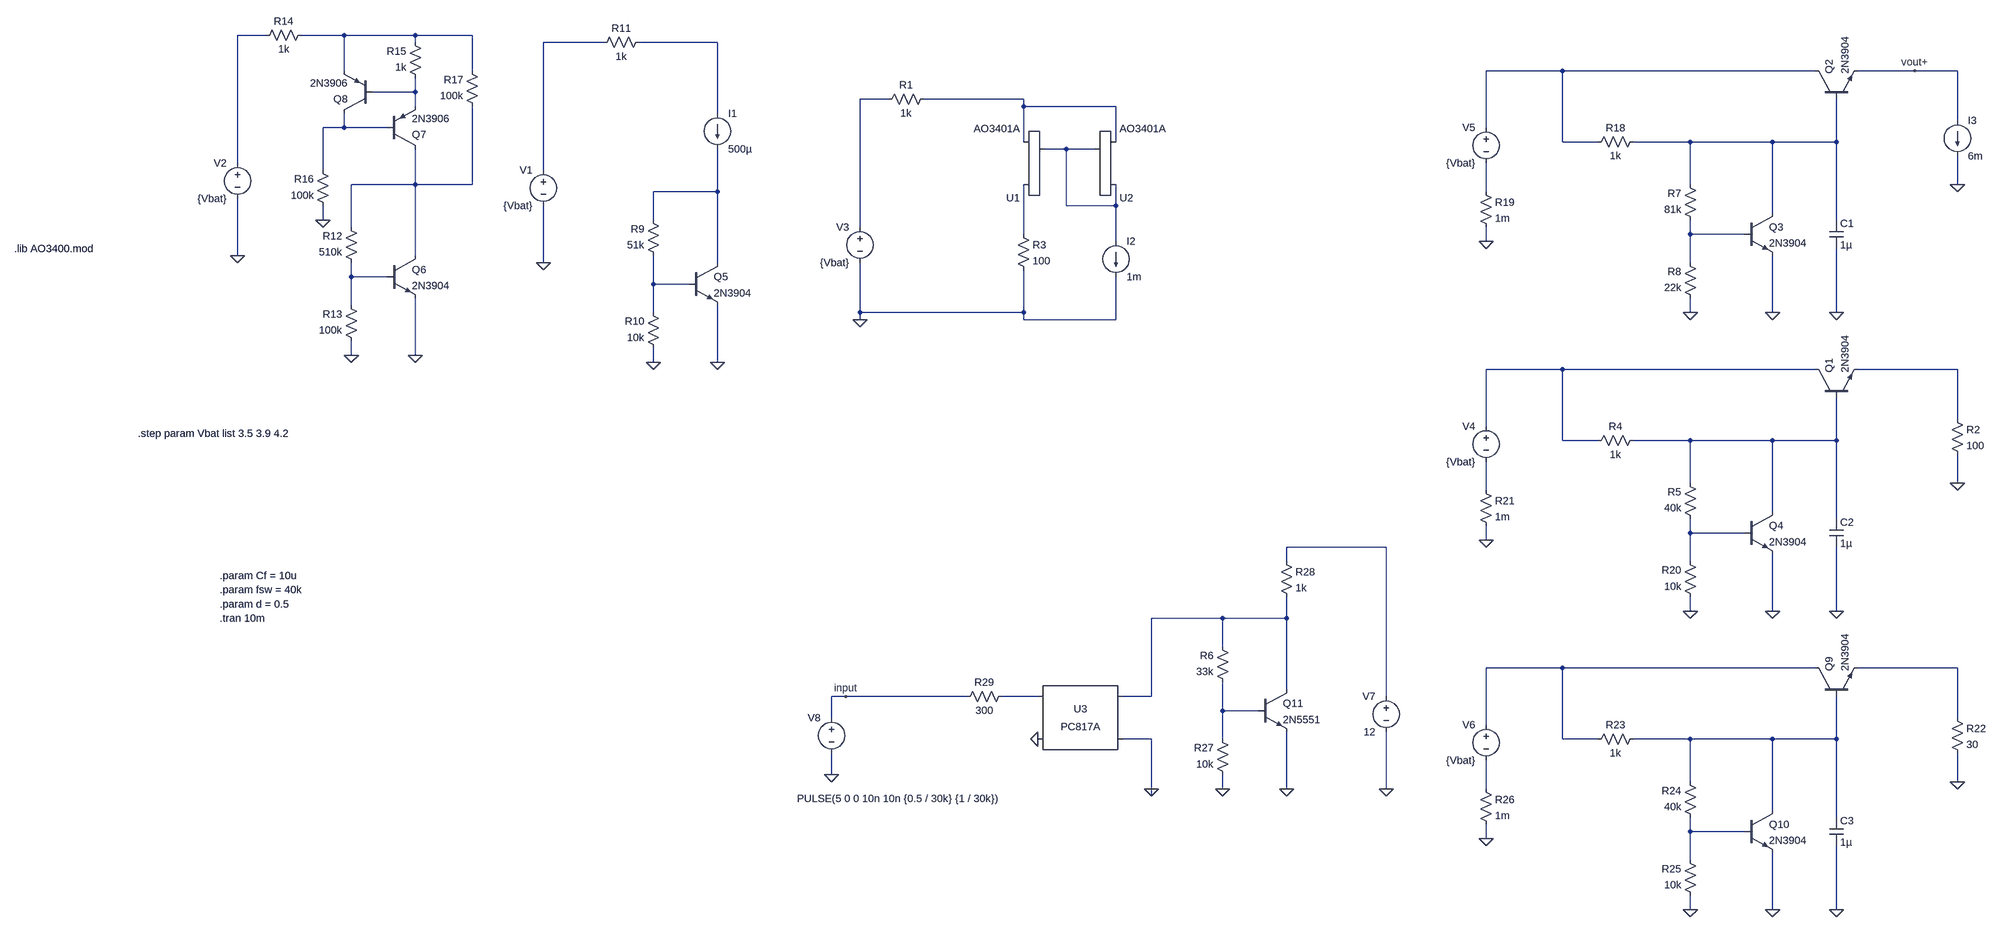
[diagram p0: schematic vbe_multiplier.asc]
vbe_multiplier.asc, the LTspice schematic file:
Version 4
SHEET 1 11460 3748
WIRE -896 -368 -960 -368
WIRE -720 -368 -816 -368
WIRE -560 -368 -720 -368
WIRE -432 -368 -560 -368
WIRE -560 -352 -560 -368
WIRE -128 -352 -272 -352
WIRE 128 -352 -48 -352
WIRE -720 -288 -720 -368
WIRE -432 -288 -432 -368
WIRE 3568 -288 3328 -288
WIRE 4272 -288 3568 -288
WIRE 4496 -288 4368 -288
WIRE 4592 -288 4496 -288
WIRE -560 -240 -560 -272
WIRE -560 -240 -656 -240
WIRE 848 -224 784 -224
WIRE 1152 -224 928 -224
WIRE -560 -208 -560 -240
WIRE 1152 -208 1152 -224
WIRE 1360 -208 1152 -208
WIRE 128 -192 128 -352
WIRE 4592 -176 4592 -288
WIRE -720 -160 -720 -192
WIRE -720 -160 -768 -160
WIRE -624 -160 -720 -160
WIRE 3328 -160 3328 -288
WIRE 1152 -128 1152 -208
WIRE 1360 -128 1360 -208
WIRE 3568 -128 3568 -288
WIRE 3648 -128 3568 -128
WIRE 3856 -128 3728 -128
WIRE 4176 -128 3856 -128
WIRE 4320 -128 4320 -224
WIRE 4320 -128 4176 -128
WIRE 1248 -112 1200 -112
WIRE 1312 -112 1248 -112
WIRE -960 -80 -960 -368
WIRE -768 -64 -768 -160
WIRE -272 -64 -272 -352
WIRE -560 -32 -560 -112
WIRE -560 -32 -704 -32
WIRE -432 -32 -432 -208
WIRE -432 -32 -560 -32
WIRE 3856 -32 3856 -128
WIRE 4592 -32 4592 -96
WIRE 128 -16 128 -112
WIRE 128 -16 -16 -16
WIRE 3328 -16 3328 -80
WIRE 1248 16 1248 -112
WIRE 1360 16 1360 -32
WIRE 1360 16 1248 16
WIRE 4176 32 4176 -128
WIRE -768 48 -768 16
WIRE -16 48 -16 -16
WIRE 4320 48 4320 -128
WIRE -704 64 -704 -32
WIRE 784 64 784 -224
WIRE 1152 80 1152 -32
WIRE 3856 80 3856 48
WIRE 4112 80 3856 80
WIRE 1360 96 1360 16
WIRE 3328 96 3328 64
WIRE -960 128 -960 0
WIRE -560 128 -560 -32
WIRE -272 144 -272 16
WIRE 128 144 128 -16
WIRE 3856 144 3856 80
WIRE -704 176 -704 144
WIRE -624 176 -704 176
WIRE -16 192 -16 128
WIRE 64 192 -16 192
WIRE -704 240 -704 176
WIRE -16 256 -16 192
WIRE 784 256 784 144
WIRE 1152 256 1152 160
WIRE 1152 256 784 256
WIRE 3856 256 3856 224
WIRE 4176 256 4176 128
WIRE 4320 256 4320 112
WIRE 784 272 784 256
WIRE 1152 272 1152 256
WIRE 1360 272 1360 176
WIRE 1360 272 1152 272
WIRE -704 352 -704 320
WIRE -560 352 -560 224
WIRE -16 368 -16 336
WIRE 128 368 128 240
WIRE 3568 384 3328 384
WIRE 4272 384 3568 384
WIRE 4592 384 4368 384
WIRE 4592 496 4592 384
WIRE 3328 512 3328 384
WIRE 3568 544 3568 384
WIRE 3648 544 3568 544
WIRE 3856 544 3728 544
WIRE 4176 544 3856 544
WIRE 4320 544 4320 448
WIRE 4320 544 4176 544
WIRE 3856 640 3856 544
WIRE 4592 640 4592 576
WIRE 3328 656 3328 592
WIRE 4176 704 4176 544
WIRE 4320 720 4320 544
WIRE 3856 752 3856 720
WIRE 4112 752 3856 752
WIRE 3328 768 3328 736
WIRE 1968 784 1744 784
WIRE 1744 816 1744 784
WIRE 3856 816 3856 752
WIRE 3856 928 3856 896
WIRE 4176 928 4176 800
WIRE 4320 928 4320 784
WIRE 1600 944 1440 944
WIRE 1744 944 1744 896
WIRE 1744 944 1600 944
WIRE 1600 1008 1600 944
WIRE 3568 1056 3328 1056
WIRE 4272 1056 3568 1056
WIRE 4592 1056 4368 1056
WIRE 1744 1104 1744 944
WIRE 752 1120 720 1120
WIRE 1024 1120 752 1120
WIRE 1184 1120 1104 1120
WIRE 1440 1120 1440 944
WIRE 1440 1120 1376 1120
WIRE 1968 1120 1968 784
WIRE 1600 1152 1600 1088
WIRE 1680 1152 1600 1152
WIRE 720 1168 720 1120
WIRE 4592 1168 4592 1056
WIRE 3328 1184 3328 1056
WIRE 1440 1216 1376 1216
WIRE 1600 1216 1600 1152
WIRE 3568 1216 3568 1056
WIRE 3648 1216 3568 1216
WIRE 3856 1216 3728 1216
WIRE 4176 1216 3856 1216
WIRE 4320 1216 4320 1120
WIRE 4320 1216 4176 1216
WIRE 720 1296 720 1248
WIRE 3856 1312 3856 1216
WIRE 4592 1312 4592 1248
WIRE 1440 1328 1440 1216
WIRE 1600 1328 1600 1296
WIRE 1744 1328 1744 1200
WIRE 1968 1328 1968 1200
WIRE 3328 1328 3328 1264
WIRE 1440 1344 1440 1328
WIRE 4176 1376 4176 1216
WIRE 4320 1392 4320 1216
WIRE 3856 1424 3856 1392
WIRE 4112 1424 3856 1424
WIRE 3328 1440 3328 1408
WIRE 3856 1488 3856 1424
WIRE 3856 1600 3856 1568
WIRE 4176 1600 4176 1472
WIRE 4320 1600 4320 1456
FLAG 128 368 0
FLAG -16 368 0
FLAG -272 144 0
FLAG -560 352 0
FLAG -704 352 0
FLAG -960 128 0
FLAG -768 48 0
FLAG 784 272 0
FLAG 4320 256 0
FLAG 4592 -32 0
FLAG 4496 -288 vout+
FLAG 3328 96 0
FLAG 4176 256 0
FLAG 3856 256 0
FLAG 4320 928 0
FLAG 4592 640 0
FLAG 3328 768 0
FLAG 4176 928 0
FLAG 3856 928 0
FLAG 4320 1600 0
FLAG 4592 1312 0
FLAG 3328 1440 0
FLAG 4176 1600 0
FLAG 3856 1600 0
FLAG 1744 1328 0
FLAG 1600 1328 0
FLAG 1968 1328 0
FLAG 720 1296 0
FLAG 752 1120 input
FLAG 1184 1216 0
FLAG 1440 1328 0
SYMBOL npn 64 144 R0
SYMATTR InstName Q5
SYMATTR Value 2N3904
SYMBOL res 0 144 R180
WINDOW 0 36 76 Left 2
WINDOW 3 36 40 Left 2
SYMATTR InstName R9
SYMATTR Value 51k
SYMBOL res 0 352 R180
WINDOW 0 36 76 Left 2
WINDOW 3 36 40 Left 2
SYMATTR InstName R10
SYMATTR Value 10k
SYMBOL voltage -272 -80 M0
WINDOW 123 0 0 Left 0
WINDOW 39 0 0 Left 0
SYMATTR InstName V1
SYMATTR Value {Vbat}
SYMBOL res -32 -368 R90
WINDOW 0 0 56 VBottom 2
WINDOW 3 32 56 VTop 2
SYMATTR InstName R11
SYMATTR Value 1k
SYMBOL current 128 -192 R0
WINDOW 123 0 0 Left 0
WINDOW 39 0 0 Left 0
SYMATTR InstName I1
SYMATTR Value 500µ
SYMBOL npn -624 128 R0
SYMATTR InstName Q6
SYMATTR Value 2N3904
SYMBOL res -688 160 R180
WINDOW 0 36 76 Left 2
WINDOW 3 36 40 Left 2
SYMATTR InstName R12
SYMATTR Value 510k
SYMBOL res -688 336 R180
WINDOW 0 36 76 Left 2
WINDOW 3 36 40 Left 2
SYMATTR InstName R13
SYMATTR Value 100k
SYMBOL voltage -960 -96 M0
WINDOW 123 0 0 Left 0
WINDOW 39 0 0 Left 0
SYMATTR InstName V2
SYMATTR Value {Vbat}
SYMBOL res -800 -384 R90
WINDOW 0 0 56 VBottom 2
WINDOW 3 32 56 VTop 2
SYMATTR InstName R14
SYMATTR Value 1k
SYMBOL pnp -624 -112 M180
SYMATTR InstName Q7
SYMATTR Value 2N3906
SYMBOL pnp -656 -192 R180
SYMATTR InstName Q8
SYMATTR Value 2N3906
SYMBOL res -544 -256 R180
WINDOW 0 36 76 Left 2
WINDOW 3 36 40 Left 2
SYMATTR InstName R15
SYMATTR Value 1k
SYMBOL res -752 32 R180
WINDOW 0 36 76 Left 2
WINDOW 3 36 40 Left 2
SYMATTR InstName R16
SYMATTR Value 100k
SYMBOL res -416 -192 R180
WINDOW 0 36 76 Left 2
WINDOW 3 36 40 Left 2
SYMATTR InstName R17
SYMATTR Value 100k
SYMBOL voltage 784 48 M0
WINDOW 123 0 0 Left 0
WINDOW 39 0 0 Left 0
SYMATTR InstName V3
SYMATTR Value {Vbat}
SYMBOL res 944 -240 R90
WINDOW 0 0 56 VBottom 2
WINDOW 3 32 56 VTop 2
SYMATTR InstName R1
SYMATTR Value 1k
SYMBOL AO3401A 1120 -64 R180
SYMATTR InstName U1
SYMBOL AO3401A 1392 -64 M180
SYMATTR InstName U2
SYMBOL res 1136 64 R0
SYMATTR InstName R3
SYMATTR Value 100
SYMBOL current 1360 96 R0
WINDOW 123 0 0 Left 0
WINDOW 39 0 0 Left 0
SYMATTR InstName I2
SYMATTR Value 1m
SYMBOL npn 4272 -224 R270
SYMATTR InstName Q2
SYMATTR Value 2N3904
SYMBOL cap 4304 48 R0
SYMATTR InstName C1
SYMATTR Value 1µ
SYMBOL res 3632 -112 R270
WINDOW 0 32 56 VTop 2
WINDOW 3 0 56 VBottom 2
SYMATTR InstName R18
SYMATTR Value 1k
SYMBOL voltage 3328 -176 M0
WINDOW 123 0 0 Left 0
WINDOW 39 0 0 Left 0
SYMATTR InstName V5
SYMATTR Value {Vbat}
SYMBOL npn 4112 32 R0
SYMATTR InstName Q3
SYMATTR Value 2N3904
SYMBOL res 3872 64 R180
WINDOW 0 36 76 Left 2
WINDOW 3 36 40 Left 2
SYMATTR InstName R7
SYMATTR Value 81k
SYMBOL res 3872 240 R180
WINDOW 0 36 76 Left 2
WINDOW 3 36 40 Left 2
SYMATTR InstName R8
SYMATTR Value 22k
SYMBOL res 3312 -32 R0
SYMATTR InstName R19
SYMATTR Value 1m
SYMBOL npn 4272 448 R270
SYMATTR InstName Q1
SYMATTR Value 2N3904
SYMBOL res 4576 480 R0
SYMATTR InstName R2
SYMATTR Value 100
SYMBOL cap 4304 720 R0
SYMATTR InstName C2
SYMATTR Value 1µ
SYMBOL res 3632 560 R270
WINDOW 0 32 56 VTop 2
WINDOW 3 0 56 VBottom 2
SYMATTR InstName R4
SYMATTR Value 1k
SYMBOL voltage 3328 496 M0
WINDOW 123 0 0 Left 0
WINDOW 39 0 0 Left 0
SYMATTR InstName V4
SYMATTR Value {Vbat}
SYMBOL npn 4112 704 R0
SYMATTR InstName Q4
SYMATTR Value 2N3904
SYMBOL res 3872 736 R180
WINDOW 0 36 76 Left 2
WINDOW 3 36 40 Left 2
SYMATTR InstName R5
SYMATTR Value 40k
SYMBOL res 3872 912 R180
WINDOW 0 36 76 Left 2
WINDOW 3 36 40 Left 2
SYMATTR InstName R20
SYMATTR Value 10k
SYMBOL res 3312 640 R0
SYMATTR InstName R21
SYMATTR Value 1m
SYMBOL npn 4272 1120 R270
SYMATTR InstName Q9
SYMATTR Value 2N3904
SYMBOL res 4576 1152 R0
SYMATTR InstName R22
SYMATTR Value 30
SYMBOL cap 4304 1392 R0
SYMATTR InstName C3
SYMATTR Value 1µ
SYMBOL res 3632 1232 R270
WINDOW 0 32 56 VTop 2
WINDOW 3 0 56 VBottom 2
SYMATTR InstName R23
SYMATTR Value 1k
SYMBOL voltage 3328 1168 M0
WINDOW 123 0 0 Left 0
WINDOW 39 0 0 Left 0
SYMATTR InstName V6
SYMATTR Value {Vbat}
SYMBOL npn 4112 1376 R0
SYMATTR InstName Q10
SYMATTR Value 2N3904
SYMBOL res 3872 1408 R180
WINDOW 0 36 76 Left 2
WINDOW 3 36 40 Left 2
SYMATTR InstName R24
SYMATTR Value 40k
SYMBOL res 3872 1584 R180
WINDOW 0 36 76 Left 2
WINDOW 3 36 40 Left 2
SYMATTR InstName R25
SYMATTR Value 10k
SYMBOL res 3312 1312 R0
SYMATTR InstName R26
SYMATTR Value 1m
SYMBOL current 4592 -176 R0
WINDOW 123 0 0 Left 0
WINDOW 39 0 0 Left 0
SYMATTR InstName I3
SYMATTR Value 6m
SYMBOL npn 1680 1104 R0
SYMATTR InstName Q11
SYMATTR Value 2N5551
SYMBOL res 1616 1104 R180
WINDOW 0 36 76 Left 2
WINDOW 3 36 40 Left 2
SYMATTR InstName R6
SYMATTR Value 33k
SYMBOL res 1616 1312 R180
WINDOW 0 36 76 Left 2
WINDOW 3 36 40 Left 2
SYMATTR InstName R27
SYMATTR Value 10k
SYMBOL res 1728 800 R0
SYMATTR InstName R28
SYMATTR Value 1k
SYMBOL voltage 1968 1104 M0
WINDOW 123 0 0 Left 0
WINDOW 39 0 0 Left 0
SYMATTR InstName V7
SYMATTR Value 12
SYMBOL Optos\\PC817A 1280 1168 R0
SYMATTR InstName U3
SYMBOL voltage 720 1152 M0
WINDOW 123 0 0 Left 0
WINDOW 39 0 0 Left 0
WINDOW 3 -378 198 Left 2
SYMATTR Value PULSE(5 0 0 10n 10n {0.5 / 30k} {1 / 30k})
SYMATTR InstName V8
SYMBOL res 1120 1104 R90
WINDOW 0 0 56 VBottom 2
WINDOW 3 32 56 VTop 2
SYMATTR InstName R29
SYMATTR Value 300
TEXT -1000 880 Left 2 !.param fsw = 40k
TEXT -1000 912 Left 2 !.param d = 0.5
TEXT -1000 848 Left 2 !.param Cf = 10u
TEXT -1000 944 Left 2 !.tran 10m
TEXT -1536 112 Left 2 !.lib AO3400.mod
TEXT -1184 528 Left 2 !.step param Vbat list 3.5 3.9 4.2

The netlist it stands for:
* vbe_multiplier.asc
Q5 N013 N018 0 0 2N3904
R9 N018 N013 51k
R10 0 N018 10k
V1 N003 0 {Vbat}
R11 N004 N003 1k
I1 N004 N013 500µ
Q6 N012 N017 0 0 2N3904
R12 N017 N012 510k
R13 0 N017 100k
V2 N001 0 {Vbat}
R14 N002 N001 1k
Q7 N012 N009 N006 0 2N3906
Q8 N009 N006 N002 0 2N3906
R15 N006 N002 1k
R16 0 N009 100k
R17 N012 N002 100k
V3 N007 0 {Vbat}
R1 N008 N007 1k
XU1 N015 N011 N008 AO3401A
XU2 N011 N011 N008 AO3401A
R3 N015 0 100
I2 N011 0 1m
Q2 N005 N010 vout+ 0 2N3904
C1 N010 0 1µ
R18 N005 N010 1k
V5 N005 N014 {Vbat}
Q3 N010 N016 0 0 2N3904
R7 N016 N010 81k
R8 0 N016 22k
R19 N014 0 1m
Q1 N019 N021 N020 0 2N3904
R2 N020 0 100
C2 N021 0 1µ
R4 N019 N021 1k
V4 N019 N022 {Vbat}
Q4 N021 N023 0 0 2N3904
R5 N023 N021 40k
R20 0 N023 10k
R21 N022 0 1m
Q9 N026 N030 N027 0 2N3904
R22 N027 0 30
C3 N030 0 1µ
R23 N026 N030 1k
V6 N026 N031 {Vbat}
Q10 N030 N032 0 0 2N3904
R24 N032 N030 40k
R25 0 N032 10k
R26 N031 0 1m
I3 vout+ 0 6m
Q11 N025 N029 0 0 2N5551
R6 N029 N025 33k
R27 0 N029 10k
R28 N024 N025 1k
V7 N024 0 12
XU3 N028 0 N025 0 PC817 Igain=1m
V8 input 0 PULSE(5 0 0 10n 10n {0.5 / 30k} {1 / 30k})
R29 N028 input 300
.model NPN NPN
.model PNP PNP
.lib standard.bjt
.param fsw = 40k
.param d = 0.5
.param Cf = 10u
.tran 10m
.lib AO3400.mod
.step param Vbat list 3.5 3.9 4.2
.lib AO3401A.mod
.lib PC817.sub
.backanno
.end